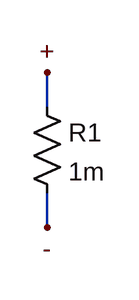
[diagram p0: schematic Amperimetro.asc]
Amperimetro.asc, the LTspice schematic file:
Version 4
SHEET 1 880 680
WIRE 192 96 192 64
WIRE 192 208 192 176
FLAG 192 64 +
FLAG 192 208 -
SYMBOL res 176 80 R0
SYMATTR InstName R1
SYMATTR Value 1m

The netlist it stands for:
* Amperimetro.asc
R1 + - 1m
.backanno
.end